# EAGLE design counter (EAGLE 9.6.2)
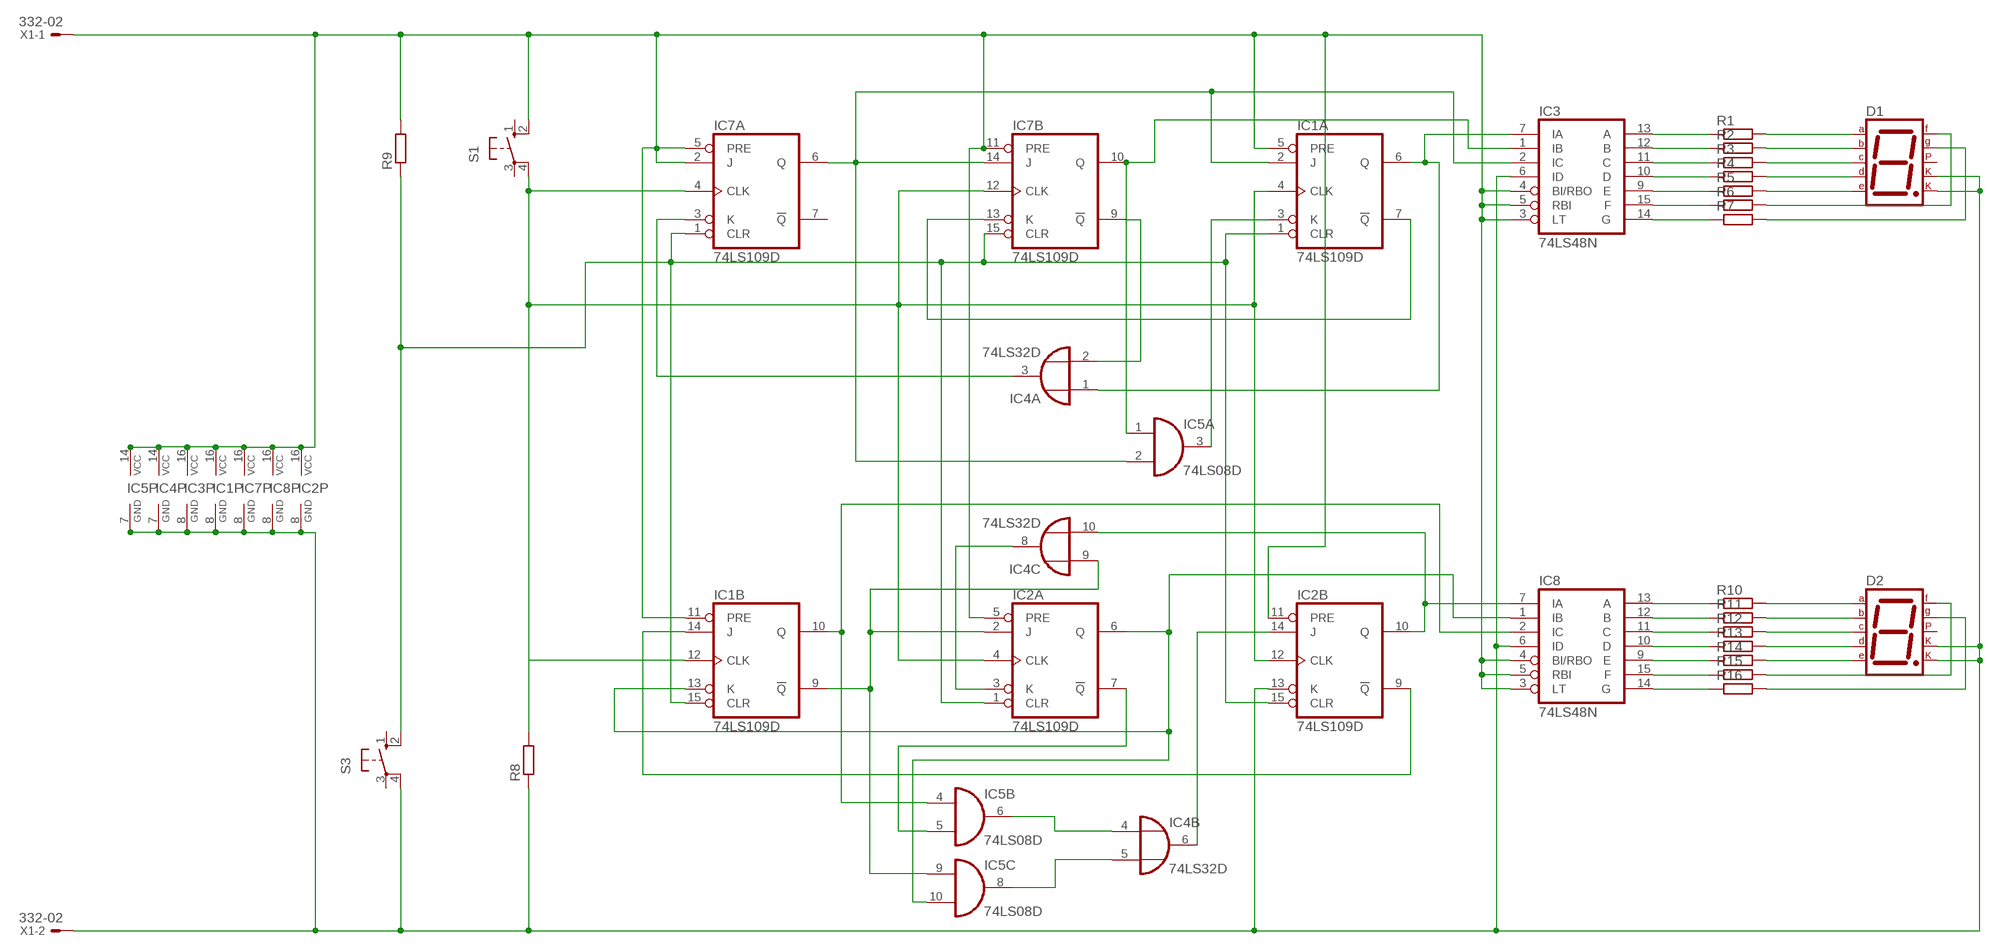
[diagram p0: schematic, sheet 1]

## Parts
D1  7SEG-CK  [7SEG-13]
D2  7SEG-CK  [7SEG-13]
IC1  74LS109D  [SO16]
IC2  74LS109D  [SO16]
IC3  74LS48N  [DIL16]
IC4  74LS32D  [SO14]
IC5  74LS08D  [SO14]
IC7  74LS109D  [SO16]
IC8  74LS48N  [DIL16]
R1  R-EU_M0805  [M0805]
R2  R-EU_M0805  [M0805]
R3  R-EU_M0805  [M0805]
R4  R-EU_M0805  [M0805]
R5  R-EU_M0805  [M0805]
R6  R-EU_M0805  [M0805]
R7  R-EU_M0805  [M0805]
R8  R-EU_M0805  [M0805]
R9  R-EU_M0805  [M0805]
R10  R-EU_M0805  [M0805]
R11  R-EU_M0805  [M0805]
R12  R-EU_M0805  [M0805]
R13  R-EU_M0805  [M0805]
R14  R-EU_M0805  [M0805]
R15  R-EU_M0805  [M0805]
R16  R-EU_M0805  [M0805]
S1  10-XX  [B3F-10XX]
S3  10-XX  [B3F-10XX]
X1  332-02  [332-02]

## Nets
N$1: IC3.13(A) R1.1
N$2: D1.7(A) R1.2
N$3: IC3.12(B) R2.1
N$4: D1.6(B) R2.2
N$5: IC3.11(C) R3.1
N$6: D1.4(C) R3.2
N$7: IC3.10(D) R4.1
N$8: D1.2(D) R4.2
N$9: IC3.9(E) R5.1
N$10: D1.1(E) R5.2
N$11: IC3.15(F) R6.1
N$12: D1.9(F) R6.2
N$13: IC3.14(G) R7.1
N$14: D1.10(G) R7.2
N$15: IC1.4(A:CLK) IC1.12(B:CLK) IC2.4(A:CLK) IC2.12(B:CLK) IC7.4(A:CLK) IC7.12(B:CLK) R8.2 S1.4(P1)
N$16: IC1.2(A:J) IC3.2(IC) IC5.2(A:I1) IC7.6(A:Q) IC7.14(B:J)
N$17: IC1.1(A:CLR) IC1.15(B:CLR) IC2.1(A:CLR) IC2.15(B:CLR) IC7.1(A:CLR) IC7.15(B:CLR) R9.1 S3.2(S1)
N$18: IC4.3(A:O) IC7.3(A:K)
N$19: IC1.7(A:!Q) IC7.13(B:K)
N$20: IC3.1(IB) IC5.1(A:I0) IC7.10(B:Q)
N$21: IC2.10(B:Q) IC4.10(C:I1) IC8.7(IA)
N$22: IC1.3(A:K) IC5.3(A:O)
N$23: IC1.14(B:J) IC2.9(B:!Q)
N$24: IC4.2(A:I1) IC7.9(B:!Q)
N$25: IC1.9(B:!Q) IC2.2(A:J) IC4.9(C:I0) IC5.9(C:I0)
N$26: IC1.6(A:Q) IC3.7(IA) IC4.1(A:I0)
N$27: IC8.13(A) R10.1
N$28: IC2.14(B:J) IC4.6(B:O)
N$29: D2.7(A) R10.2
N$30: IC8.12(B) R11.1
N$31: D2.6(B) R11.2
N$32: IC8.11(C) R12.1
N$33: D2.4(C) R12.2
N$34: IC8.10(D) R13.1
N$35: D2.2(D) R13.2
N$36: IC8.9(E) R14.1
N$37: D2.1(E) R14.2
N$38: IC8.15(F) R15.1
N$39: D2.9(F) R15.2
N$40: IC8.14(G) R16.1
N$41: D2.10(G) R16.2
N$43: IC1.5(A:PRE) IC1.11(B:PRE) IC1.16(P:VCC) IC2.5(A:PRE) IC2.11(B:PRE) IC2.16(P:VCC) IC3.3(LT) IC3.4(BI/RBO) IC3.5(RBI) IC3.16(VCC) IC4.14(P:VCC) IC5.14(P:VCC) IC7.2(A:J) IC7.5(A:PRE) IC7.11(B:PRE) IC7.16(P:VCC) IC8.3(LT) IC8.4(BI/RBO) IC8.5(RBI) IC8.16(VCC) R9.2 S1.2(S1) X1.1
N$44: D1.3(CK1) D1.8(CK2) D2.3(CK1) D2.8(CK2) IC1.8(P:GND) IC2.8(P:GND) IC2.13(B:K) IC3.6(ID) IC3.8(GND) IC4.7(P:GND) IC5.7(P:GND) IC7.8(P:GND) IC8.6(ID) IC8.8(GND) R8.1 S3.4(P1) X1.2
N$45: IC2.7(A:!Q) IC5.5(B:I1)
N$46: IC4.4(B:I0) IC5.6(B:O)
N$47: IC4.5(B:I1) IC5.8(C:O)
N$49: IC1.10(B:Q) IC5.4(B:I0) IC8.2(IC)
N$50: IC2.3(A:K) IC4.8(C:O)
N$53: IC1.13(B:K) IC2.6(A:Q) IC5.10(C:I1) IC8.1(IB)
Unconnected: D1.5(DP) D2.5(DP) IC4.11(D:O) IC4.12(D:I0) IC4.13(D:I1) IC5.11(D:O) IC5.12(D:I0) IC5.13(D:I1) IC7.7(A:!Q) S1.1(S) S1.3(P) S3.1(S) S3.3(P)

## Library data of the parts
D1 D2 = special:7SEG-CK: 7-segment DISPLAY single cathode, 13 mm
IC1 IC2 IC7 = 74xx-eu:74*109: Dual J-K positive edge triggered FLIP FLOP, preset and clear
IC3 IC8 = 74xx-eu:74*48: BCD to seven segment DECODER/DRIVER
IC4 = 74xx-eu:74*32: Quad 2-input OR gate
IC5 = 74xx-eu:74*08: Quad 2-input AND gate
R1-R16 = rcl:R-EU_: RESISTOR, European symbol
S1 S3 = switch-omron:10-XX: OMRON SWITCH; MPN: B3F-1000; OC_FARNELL: 176432; OC_NEWARK: 36M3542
X1 = con-garry:332-02: 2 Pin - 2mm Dual Row Source: www.mpe-connector.de / garry_shortform_2012.pdf

## Board
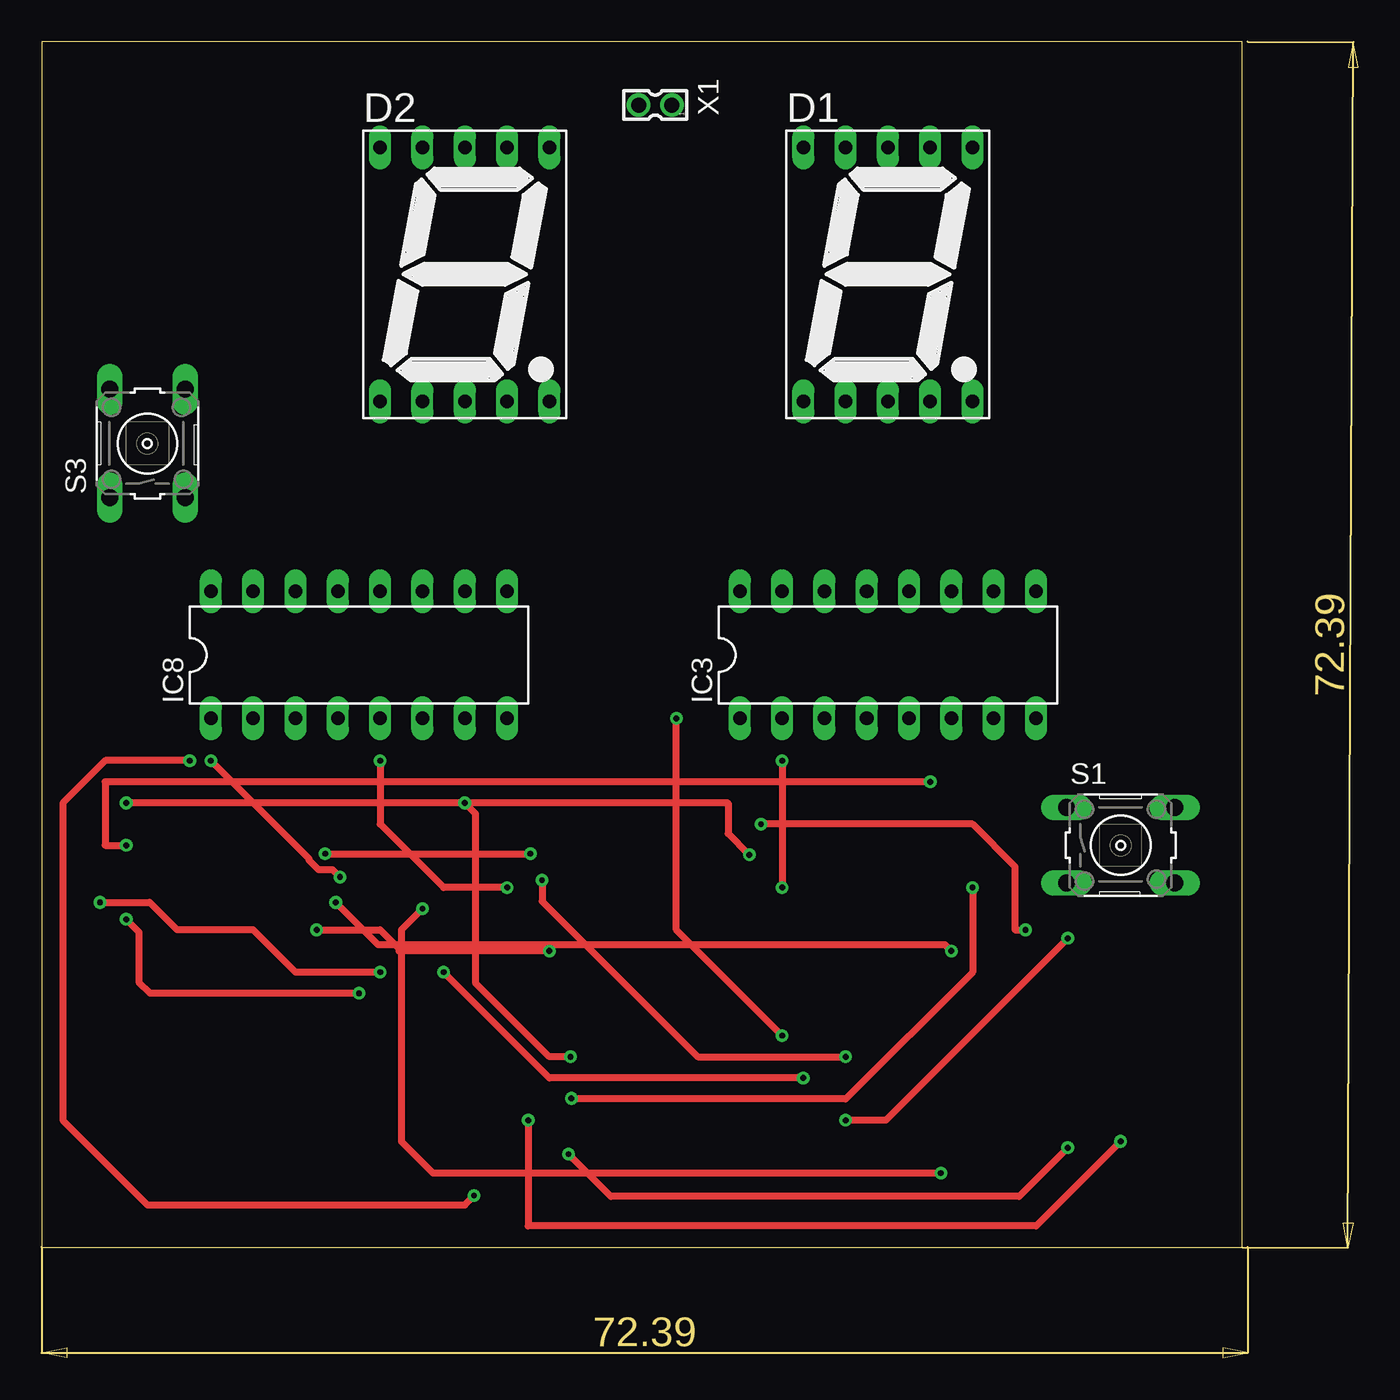
[diagram p1: board, top side]
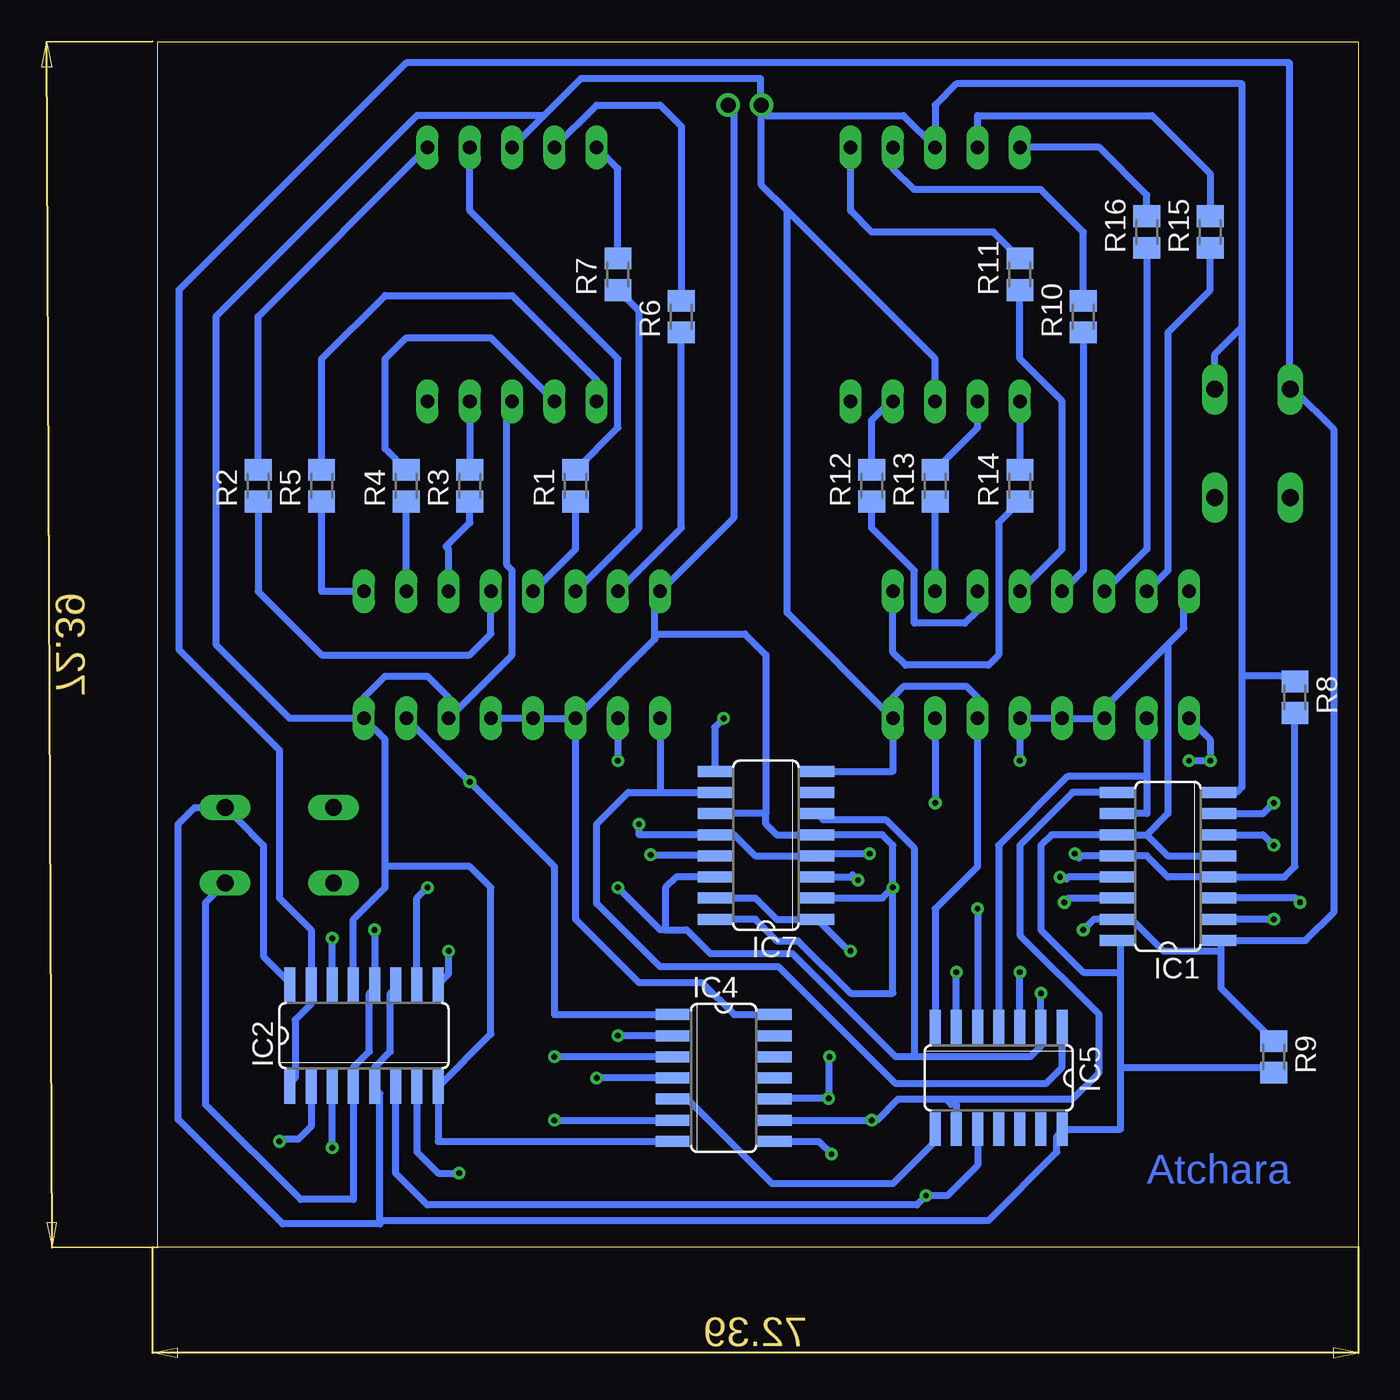
[diagram p2: board, bottom side, seen from below]

Size 72.06 x 72.38 mm. Coordinates in mm from the lower left corner, seen from the top.
Outline: 0,0 72.06,0 72.06,72.38 0,72.38 0,0
Copper layers (1*16): Top 0.035mm / dielectric 1.5mm / Bottom 0.035mm
Design rules "default *": minimum track width 16mil, minimum drill 0.35mm, track to track 15mil, track to pad 15mil, pad to pad 15mil, via to via 15mil, smd to smd 15mil, copper to edge 40mil, drill to drill 6mil, minimum pad ring 10mil, minimum via ring 8mil, stop-mask expansion 4mil, vias tented up to drill 0mil, thermal gap 10mil

### Footprints (pad centres in the part's own frame; a part is rotated, then mirrored left to right if it is on the bottom)
7SEG-13 = drill 0.813 long: 1 -5.08,-7.62; 2 -2.54,-7.62; 3 0,-7.62; 4 2.54,-7.62; 5 5.08,-7.62; 6 5.08,7.62; 7 2.54,7.62; 8 0,7.62; 9 -2.54,7.62; 10 -5.08,7.62
SO16 = smd 0.66 x 2.032: 1 -4.445,-3.073; 2 -3.175,-3.073; 3 -1.905,-3.073; 4 -0.635,-3.073; 5 0.635,-3.073; 6 1.905,-3.073; 7 3.175,-3.073; 8 4.445,-3.073; 9 4.445,3.073; 10 3.175,3.073; 11 1.905,3.073; 12 0.635,3.073; 13 -0.635,3.073; 14 -1.905,3.073; 15 -3.175,3.073; 16 -4.445,3.073
DIL16 = drill 0.813 long: 1 -8.89,-3.81; 2 -6.35,-3.81; 3 -3.81,-3.81; 4 -1.27,-3.81; 5 1.27,-3.81; 6 3.81,-3.81; 7 6.35,-3.81; 8 8.89,-3.81; 9 8.89,3.81; 10 6.35,3.81; 11 3.81,3.81; 12 1.27,3.81; 13 -1.27,3.81; 14 -3.81,3.81; 15 -6.35,3.81; 16 -8.89,3.81
SO14 = smd 0.66 x 2.032: 1 -3.81,-3.073; 2 -2.54,-3.073; 3 -1.27,-3.073; 4 0,-3.073; 5 1.27,-3.073; 6 2.54,-3.073; 7 3.81,-3.073; 8 3.81,3.073; 9 2.54,3.073; 10 1.27,3.073; 11 0,3.073; 12 -1.27,3.073; 13 -2.54,3.073; 14 -3.81,3.073
M0805 = smd 1.3 x 1.6: 1 -0.95,0; 2 0.95,0
B3F-10XX = drill 1.016 long: 1 -3.251,2.261; 2 3.251,2.261; 3 -3.251,-2.261; 4 3.251,-2.261
332-02 = drill 0.9 pad 1.27: 1 0,-1; 2 0,1

### Placement (x,y rotation side)
D1  50.8,58.42 0 top
D2  25.4,58.42 0 top
IC1  11.43,22.86 90 bottom
IC2  59.69,12.7 0 bottom
IC3  50.8,35.56 0 top
IC4  38.1,10.16 270 bottom
IC5  21.59,10.16 180 bottom
IC7  35.56,24.13 90 bottom
IC8  19.05,35.56 0 top
R1  46.99,45.72 90 bottom
R2  66.04,45.72 90 bottom
R3  53.34,45.72 90 bottom
R4  57.15,45.72 90 bottom
R5  62.23,45.72 90 bottom
R6  40.64,55.88 90 bottom
R7  44.45,58.42 90 bottom
R8  3.81,33.02 270 bottom
R9  5.08,11.43 270 bottom
R10  16.51,55.88 90 bottom
R11  20.32,58.42 90 bottom
R12  29.21,45.72 90 bottom
R13  25.4,45.72 90 bottom
R14  20.32,45.72 90 bottom
R15  8.89,60.96 90 bottom
R16  12.7,60.96 90 bottom
S1  64.77,24.13 0 top
S3  6.35,48.26 90 top
X1  36.83,68.58 90 top

### Tracks (layer width: path | path; a pad name or v marks a point on that pad's centre or on a via)
N$1
  Bottom 0.406: IC3.13 46.99,41.91 R1.1
N$2
  Bottom 0.406: R1.2 44.45,49.21 44.45,53.34 53.34,62.23 D1.7
N$3
  Bottom 0.406: R2.1 66.04,39.37 62.23,35.56 53.34,35.56 52.07,36.83 IC3.12
N$4
  Bottom 0.406: 66.04,46.35 R2.2 66.04,55.88 D1.6
N$5
  Bottom 0.406: IC3.11 54.61,41.91 54.77,42.07 53.34,43.5 R3.1
N$6
  Bottom 0.406: D1.4 R3.2
N$7
  Bottom 0.406: IC3.10 R4.1
N$8
  Bottom 0.406: R4.2 58.42,47.94 58.42,53.34 57.15,54.61 52.07,54.61 D1.2
N$9
  Bottom 0.406: IC3.9 62.23,39.37 R5.1
N$10
  Bottom 0.406: R5.2 62.23,53.34 58.42,57.15 50.8,57.15 45.72,52.07 D1.1
N$11
  Bottom 0.406: IC3.15 40.64,43.18 R6.1
N$12
  Bottom 0.406: D1.9 45.72,68.58 41.91,68.58 40.64,67.31 R6.2
N$13
  Bottom 0.406: IC3.14 43.18,43.18 43.18,56.2 R7.1
N$14
  Bottom 0.406: R7.2 44.45,64.77 D1.10
N$15  (via drill 0.35)
  Top 0.406: v43.18,25.4 55.88,25.4 58.42,22.86 58.42,19.05 v59.05,19.05 | v17.02,23.62 v29.34,23.62
  Bottom 0.406: IC1.4 7.3,22.23 | IC1.4 11.43,22.23 12.7,23.49 IC1.12 16.64,23.49 16.76,23.37 v17.02,23.62 | S1.4 69.22,20.68 69.22,8.57 63.5,2.86 60.33,2.86 IC2.4 60.33,10.79 59.37,11.75 59.37,15.24 59.05,15.56 IC2.12 v59.05,19.05 | IC1.4 4.45,22.23 3.81,22.86 R8.2 | v43.18,25.4 43.18,24.77 IC7.12 37.47,24.77 36.2,23.49 IC7.4 32.36,23.62 v29.34,23.62
N$16  (via drill 0.35)
  Top 0.406: v44.45,29.21 v44.45,21.59 | v19.05,15.24 6.51,15.24 5.84,15.9 5.84,18.92 v5.08,19.68
  Bottom 0.406: 41.59,19.05 41.59,21.59 40.96,22.23 IC7.14 | IC3.2 v44.45,29.21 | 41.59,19.05 40.32,19.05 38.89,17.61 33.96,17.61 27.78,11.43 26.67,11.43 | 26.67,11.43 19.68,11.43 19.05,12.06 IC5.2 v19.05,15.24 | IC7.6 32.13,25.68 28.38,25.68 26.67,23.97 26.67,11.43 | v5.08,19.68 IC1.2 | 41.59,19.05 41.91,19.05 v44.45,21.59
N$17  (via drill 0.35)
  Top 0.406: v30.48,17.78 21.45,17.78 21.52,17.85 20.32,19.05 v16.51,19.05
  Bottom 0.406: IC2.1 64.13,9.84 63.82,10.16 63.82,13.65 62.86,14.6 IC2.15 62.86,19.05 64.77,20.95 64.77,29.84 70.8,35.88 70.8,57.47 57.15,71.12 4.13,71.12 4.13,51.75 3.81,51.43 | 8.25,17.78 8.25,18.41 IC1.1 3.18,18.41 1.46,20.13 1.46,49.09 3.81,51.43 | 8.25,17.78 8.25,15.56 R9.1 | 3.81,51.43 S3.2 | IC7.15 36.2,20.95 34.92,19.68 IC7.1 30.58,17.78 v30.48,17.78 | 8.25,17.78 11.7,17.78 13.6,19.68 IC1.15 15.88,19.68 v16.51,19.05
N$18  (via drill 0.35)
  Top 0.406: v30.04,22.03 30.04,20.77 39.37,11.43 v48.26,11.43
  Bottom 0.406: IC4.3 v48.26,11.43 | IC7.3 30.48,22.23 30.35,22.35 v30.04,22.03
N$19  (via drill 0.35)
  Top 0.406: v42.48,23.56 41.21,24.83 41.21,26.67 v5.08,26.67
  Bottom 0.406: IC1.7 5.71,26.03 v5.08,26.67 | v42.48,23.56 38.7,23.56 IC7.13
N$20
  Bottom 0.406: 42.23,31.43 IC3.1 41.91,27.3 | IC5.1 17.78,10.79 18.73,9.84 27.81,9.84 34.8,16.83 41.91,16.83 45.72,20.64 45.72,25.4 43.81,27.3 41.91,27.3 | 41.91,27.3 IC7.10
N$21  (via drill 0.35)
  Top 0.406: v55.88,21.59 55.88,16.51 48.26,8.89 31.75,8.89 v31.8,8.94 | v25.4,26.67 26.04,26.03 26.04,15.87 30.48,11.43 v31.75,11.43
  Bottom 0.406: 25.4,30.48 IC8.7 v25.4,26.67 | IC2.10 56.52,20.95 v55.88,21.59 | IC4.10 34.98,8.94 v31.8,8.94 31.8,11.38 v31.75,11.43
N$22  (via drill 0.35)
  Top 0.406: v20.32,16.51 15.24,16.51 12.7,19.05 8.13,19.05 6.48,20.7 v3.5,20.7
  Bottom 0.406: IC5.3 v20.32,16.51 | v3.5,20.7 3.76,20.95 IC1.3
N$23  (via drill 0.35)
  Top 0.406: v17.65,20.7 20.19,18.16 54.23,18.16 v54.61,17.78
  Bottom 0.406: IC2.9 54.61,16.41 v54.61,17.78 | v17.65,20.7 17.4,20.95 IC1.14
N$24  (via drill 0.35)
  Top 0.406: v44.45,12.7 38.1,19.05 v38.1,31.75
  Bottom 0.406: IC4.2 v44.45,12.7 | v38.1,31.75 38.63,31.22 IC7.9
N$25  (via drill 0.35)
  Top 0.406: v64.77,6.35 59.69,1.27 29.21,1.27 v29.21,7.62
  Bottom 0.406: 24.77,8.89 24.45,8.57 24.45,8.89 24.13,8.57 IC5.9 | 24.77,8.89 27.62,8.89 28.89,7.62 v29.21,7.62 IC4.9 | IC1.9 17.14,27.3 20.32,24.13 20.32,18.73 15.56,13.97 15.56,10.48 17.14,8.89 24.77,8.89 | IC2.2 62.86,7.24 63.63,6.48 64.64,6.48 v64.77,6.35
N$26  (via drill 0.35)
  Top 0.406: v53.34,27.94 3.81,27.94 3.81,24.13 v5.08,24.13
  Bottom 0.406: IC4.1 48.26,13.97 48.26,22.86 v53.34,27.94 IC3.7 | IC1.6 5.71,24.77 v5.08,24.13
N$27
  Bottom 0.406: R10.1 16.51,40.64 IC8.13
N$28  (via drill 0.35)
  Top 0.406: v61.59,18.54 50.67,7.62 v48.26,7.62
  Bottom 0.406: IC2.14 v61.59,18.54 | v48.26,7.62 IC4.6
N$29
  Bottom 0.406: R10.2 16.51,60.96 19.05,63.5 26.67,63.5 27.94,64.77 D2.7
N$30
  Bottom 0.406: IC8.12 17.78,41.91 17.78,50.8 20.32,53.34 R11.1
N$31
  Bottom 0.406: R11.2 21.91,60.96 29.21,60.96 30.48,62.23 D2.6
N$32
  Bottom 0.406: IC8.11 22.86,38.22 23.61,37.46 26.64,37.46 26.64,40.61 29.21,43.18 R12.1
N$33
  Bottom 0.406: R12.2 29.21,49.65 28.06,50.8 D2.4
N$34
  Bottom 0.406: IC8.10 R13.1
N$35
  Bottom 0.406: R13.2 22.86,49.21 D2.2
N$36
  Bottom 0.406: R14.1 21.59,43.5 21.59,35.56 22.2,34.95 27.18,34.95 27.94,35.71 IC8.9
N$37
  Bottom 0.406: D2.1 R14.2
N$38
  Bottom 0.406: IC8.15 11.43,40.64 11.43,54.93 8.89,57.47 R15.1
N$39
  Bottom 0.406: D2.9 22.86,67.95 12.38,67.95 8.89,64.45 R15.2
N$40
  Bottom 0.406: R16.1 12.7,41.91 IC8.14
N$41
  Bottom 0.406: R16.2 12.7,63.18 15.56,66.04 D2.10
N$43  (via drill 0.35)
  Top 0.406: v27.94,21.59 24.13,21.59 20.32,25.4 v20.32,29.21
  Bottom 0.406: IC8.16 10.48,39.05 10.48,37.15 11.43,36.2 | 11.43,36.2 15.24,32.38 IC8.3 IC8.4 IC8.5 v20.32,29.21 | IC3.3 IC3.4 IC3.5 52.07,31.11 | 42.23,36.83 42.23,36.51 IC3.3 | 42.23,36.83 42.23,39.05 IC3.16 37.47,43.81 37.47,68.26 37.78,68.58 X1.1 | IC1.5 11.43,23.49 12.7,24.77 | 12.7,24.77 IC1.11 18.41,24.77 19.05,24.13 19.05,19.05 16.51,16.51 14.29,16.51 | 12.7,24.77 11.43,26.03 11.43,36.2 | 14.29,10.79 5.08,10.79 R9.2 | 14.29,16.51 14.29,18.41 IC1.16 | 14.29,16.51 14.29,10.79 | 14.29,10.79 14.29,7.09 IC5.14 17.78,6.99 18.1,6.67 18.1,5.71 22.22,1.59 58.74,1.59 | 67.31,25.72 67.94,26.35 S1.2 | 67.31,25.72 65.72,24.13 65.72,17.46 64.13,15.87 IC2.16 | IC7.16 36.2,19.68 34.91,18.4 33.64,18.4 30.47,15.24 27.94,15.24 v27.94,21.59 | 35.56,26.03 IC7.11 | 35.56,26.03 35.56,25.4 34.92,24.77 IC7.5 28.57,24.77 27.94,24.13 v27.94,21.59 | IC2.11 57.78,15.56 58.1,15.24 58.1,11.75 59.05,10.79 IC2.5 59.05,9.53 58.74,9.21 58.74,1.59 | IC4.14 37.47,13.97 39.37,15.87 43.18,15.87 46.99,19.68 IC3.3 | 58.74,1.59 58.74,1.4 64.58,1.4 70.84,7.66 70.84,25.4 69.85,26.39 S1.2 | 67.31,25.72 S1.2 | 42.23,36.83 36.83,36.83 35.56,35.56 35.56,26.03 | IC7.2 28.57,20.95 v27.94,21.59
N$44
  Bottom 0.406: D1.3 51.12,50.48 51.12,40.96 50.8,40.64 50.8,35.56 IC3.6 54.61,33.02 55.88,34.29 58.42,34.29 59.69,33.02 IC3.8 | IC3.8 64.13,31.75 68.58,36.2 68.58,55.88 56.52,67.95 48.89,67.95 | 35.56,67.95 35.56,68.58 X1.2 | 35.56,67.95 27.31,67.95 D2.8 25.4,68.58 24.13,69.85 6.98,69.85 6.98,55.24 | 35.56,67.95 X1.2 | 48.89,67.95 46.67,70.17 35.88,70.17 35.88,68.58 X1.2 | 48.89,67.95 D1.8 | S3.4 8.61,53.62 6.98,55.24 | D2.3 25.4,53.34 34.29,62.23 | X1.2 35.83,63.77 34.29,62.23 | IC8.8 34.29,38.1 34.29,62.23 | IC4.7 55.24,6.35 IC2.8 | IC1.8 7.3,27.3 6.98,27.62 6.98,34.29 | IC8.8 27.94,28.57 IC7.8 | IC5.7 25.4,20.32 22.86,22.86 IC8.6 22.86,33.02 23.5,33.66 27.31,33.66 27.94,33.02 IC8.8 | 60.33,15.87 IC2.13 60.33,19.68 58.42,21.59 58.42,22.86 | 6.98,55.24 6.98,34.29 | 55.24,9.84 IC2.8 | 58.42,22.86 58.42,30.48 IC3.8 | IC2.8 52.07,12.8 52.07,21.59 53.34,22.86 58.42,22.86 | R8.1 4.13,34.29 6.98,34.29
N$45  (via drill 0.35)
  Top 0.406: v53.97,4.44 23.5,4.44 21.59,6.35 21.59,19.05 v22.86,20.32
  Bottom 0.406: IC2.7 56.52,5.71 55.24,4.44 v53.97,4.44 | v22.86,20.32 IC5.5
N$46  (via drill 0.35)
  Top 0.406: v45.72,10.16 30.48,10.16 v24.13,16.51
  Bottom 0.406: IC5.6 v24.13,16.51 | IC4.4 v45.72,10.16
N$47
  Bottom 0.406: IC5.8 25.4,6.35 27.94,3.81 35.19,3.81 40.27,8.89 IC4.5
N$49
  Bottom 0.406: IC1.10 12.7,26.03 12.7,28.26 | IC8.2 12.7,28.26 | IC5.4 21.59,24.13 17.46,28.26 12.7,28.26
N$50  (via drill 0.35)
  Top 0.406: v31.62,5.59 34.16,3.05 58.67,3.05 v61.59,5.97
  Bottom 0.406: v31.62,5.59 32.39,6.35 IC4.8 | v61.59,5.97 IC2.3
N$53  (via drill 0.35)
  Top 0.406: v8.89,29.21 3.81,29.21 1.27,26.67 1.27,7.62 6.35,2.54 25.4,2.54 v25.95,3.09 | v17.91,22.23 17.47,22.66 16.62,22.66 16.06,23.22 16.06,23.31 v10.16,29.21
  Bottom 0.406: IC5.10 22.86,4.91 24.68,3.09 v25.95,3.09 26.5,2.54 55.88,2.54 57.78,4.44 IC2.6 | IC8.1 8.89,30.48 v8.89,29.21 v10.16,29.21 | IC1.13 17.4,22.23 17.53,22.1 17.78,22.1 v17.91,22.23

### Text on the board
Bottom: Atchara